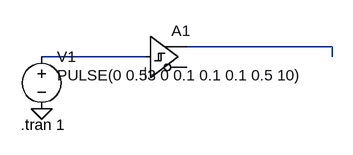
[diagram p0: schematic Schmitt Trigger Test.asc]
Schmitt Trigger Test.asc, the LTspice schematic file:
Version 4.1
SHEET 1 880 680
WIRE 448 192 224 192
WIRE 160 208 0 208
WIRE 448 208 448 192
FLAG 0 288 0
SYMBOL Digital\\schmitt 160 144 R0
SYMATTR InstName A1
SYMBOL voltage 0 192 R0
WINDOW 3 24 44 Left 2
WINDOW 123 0 0 Left 0
WINDOW 39 0 0 Left 0
SYMATTR InstName V1
SYMATTR Value PULSE(0 0.53 0 0.1 0.1 0.1 0.5 10)
TEXT -32 312 Left 2 !.tran 1

The netlist it stands for:
* Schmitt Trigger Test.asc
A1 N002 0 0 0 0 0 N001 0 SCHMITT
V1 N002 0 PULSE(0 0.53 0 0.1 0.1 0.1 0.5 10)
.tran 1
.backanno
.end